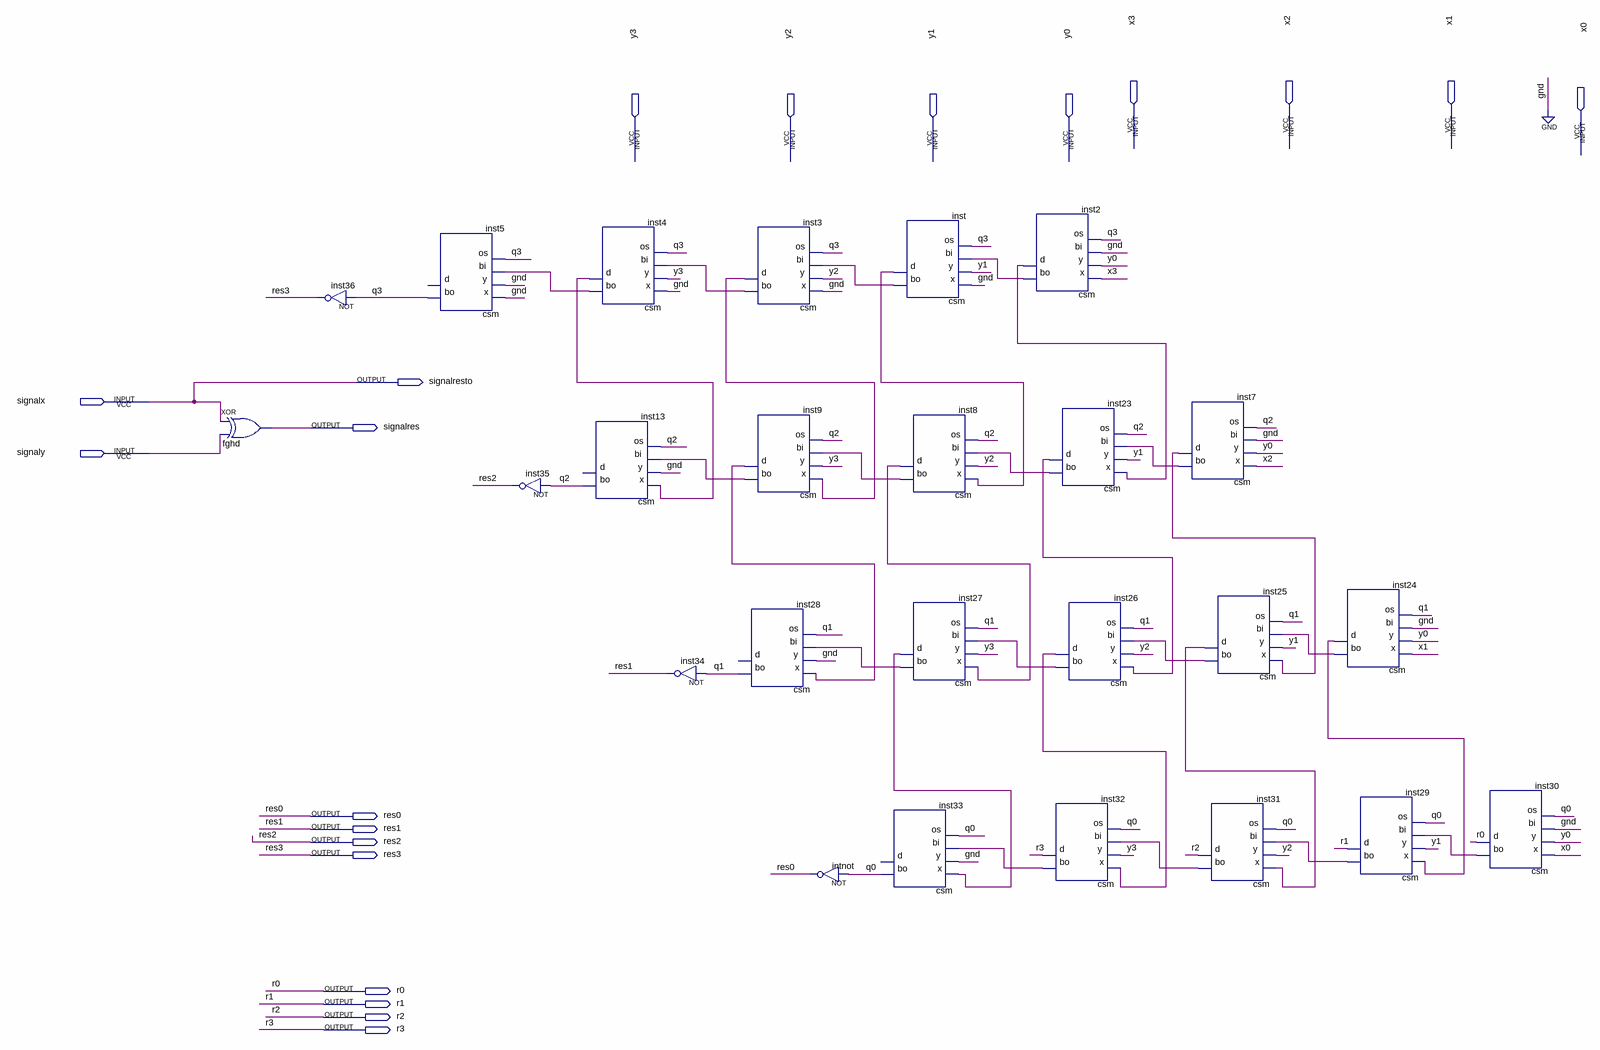
[diagram p0: schematic sheet]
// Quartus schematic divisor.bdf as structural Verilog: 25 symbols, 20 pins
module divisor (
  input  x3,
  input  x2,
  input  x1,
  input  x0,
  input  y3,
  input  y2,
  input  y1,
  input  y0,
  input  signalx,
  input  signaly,
  output signalresto,
  output signalres,
  output res0,
  output res1,
  output res2,
  output res3,
  output r0,
  output r1,
  output r2,
  output r3
);

  wire inst2_bo, inst2_d, inst3_bo, inst3_d, inst4_bo, inst4_d, inst7_bo, inst7_d, inst8_bo, inst8_d,
       inst9_bo, inst9_d, inst23_bo, inst23_d, inst24_bo, inst24_d, inst25_bo, inst25_d, inst26_bo, inst26_d,
       inst27_bo, inst27_d, inst29_bo, inst30_bo, inst31_bo, inst32_bo, inst_bo, inst_d, q0, q1, q2, q3;

  xor fghd (signalres, signalx, signaly);
  not inst36 (res3, q3);
  csm inst5 (.x(1'b0), .y(1'b0), .bi(inst4_bo), .os(q3), .bo(q3));  // open: d
  not inst35 (res2, q2);
  csm inst4 (.x(1'b0), .y(y3), .bi(inst3_bo), .os(q3), .bo(inst4_bo), .d(inst4_d));
  csm inst13 (.x(inst4_d), .y(1'b0), .bi(inst9_bo), .os(q2), .bo(q2));  // open: d
  not inst34 (res1, q1);
  csm inst3 (.x(1'b0), .y(y2), .bi(inst_bo), .os(q3), .bo(inst3_bo), .d(inst3_d));
  csm inst9 (.x(inst3_d), .y(y3), .bi(inst8_bo), .os(q2), .bo(inst9_bo), .d(inst9_d));
  csm inst28 (.x(inst9_d), .y(1'b0), .bi(inst27_bo), .os(q1), .bo(q1));  // open: d
  not intnot (res0, q0);
  csm inst33 (.x(inst27_d), .y(1'b0), .bi(inst32_bo), .os(q0), .bo(q0));  // open: d
  csm inst (.x(1'b0), .y(y1), .bi(inst2_bo), .os(q3), .bo(inst_bo), .d(inst_d));
  csm inst8 (.x(inst_d), .y(y2), .bi(inst23_bo), .os(q2), .bo(inst8_bo), .d(inst8_d));
  csm inst27 (.x(inst8_d), .y(y3), .bi(inst26_bo), .os(q1), .bo(inst27_bo), .d(inst27_d));
  csm inst2 (.x(x3), .y(y0), .bi(1'b0), .os(q3), .bo(inst2_bo), .d(inst2_d));
  csm inst23 (.x(inst2_d), .y(y1), .bi(inst7_bo), .os(q2), .bo(inst23_bo), .d(inst23_d));
  csm inst26 (.x(inst23_d), .y(y2), .bi(inst25_bo), .os(q1), .bo(inst26_bo), .d(inst26_d));
  csm inst32 (.x(inst26_d), .y(y3), .bi(inst31_bo), .os(q0), .bo(inst32_bo), .d(r3));
  csm inst7 (.x(x2), .y(y0), .bi(1'b0), .os(q2), .bo(inst7_bo), .d(inst7_d));
  csm inst25 (.x(inst7_d), .y(y1), .bi(inst24_bo), .os(q1), .bo(inst25_bo), .d(inst25_d));
  csm inst31 (.x(inst25_d), .y(y2), .bi(inst29_bo), .os(q0), .bo(inst31_bo), .d(r2));
  csm inst24 (.x(x1), .y(y0), .bi(1'b0), .os(q1), .bo(inst24_bo), .d(inst24_d));
  csm inst29 (.x(inst24_d), .y(y1), .bi(inst30_bo), .os(q0), .bo(inst29_bo), .d(r1));
  csm inst30 (.x(x0), .y(y0), .bi(1'b0), .os(q0), .bo(inst30_bo), .d(r0));

  assign signalresto = signalx;
endmodule
